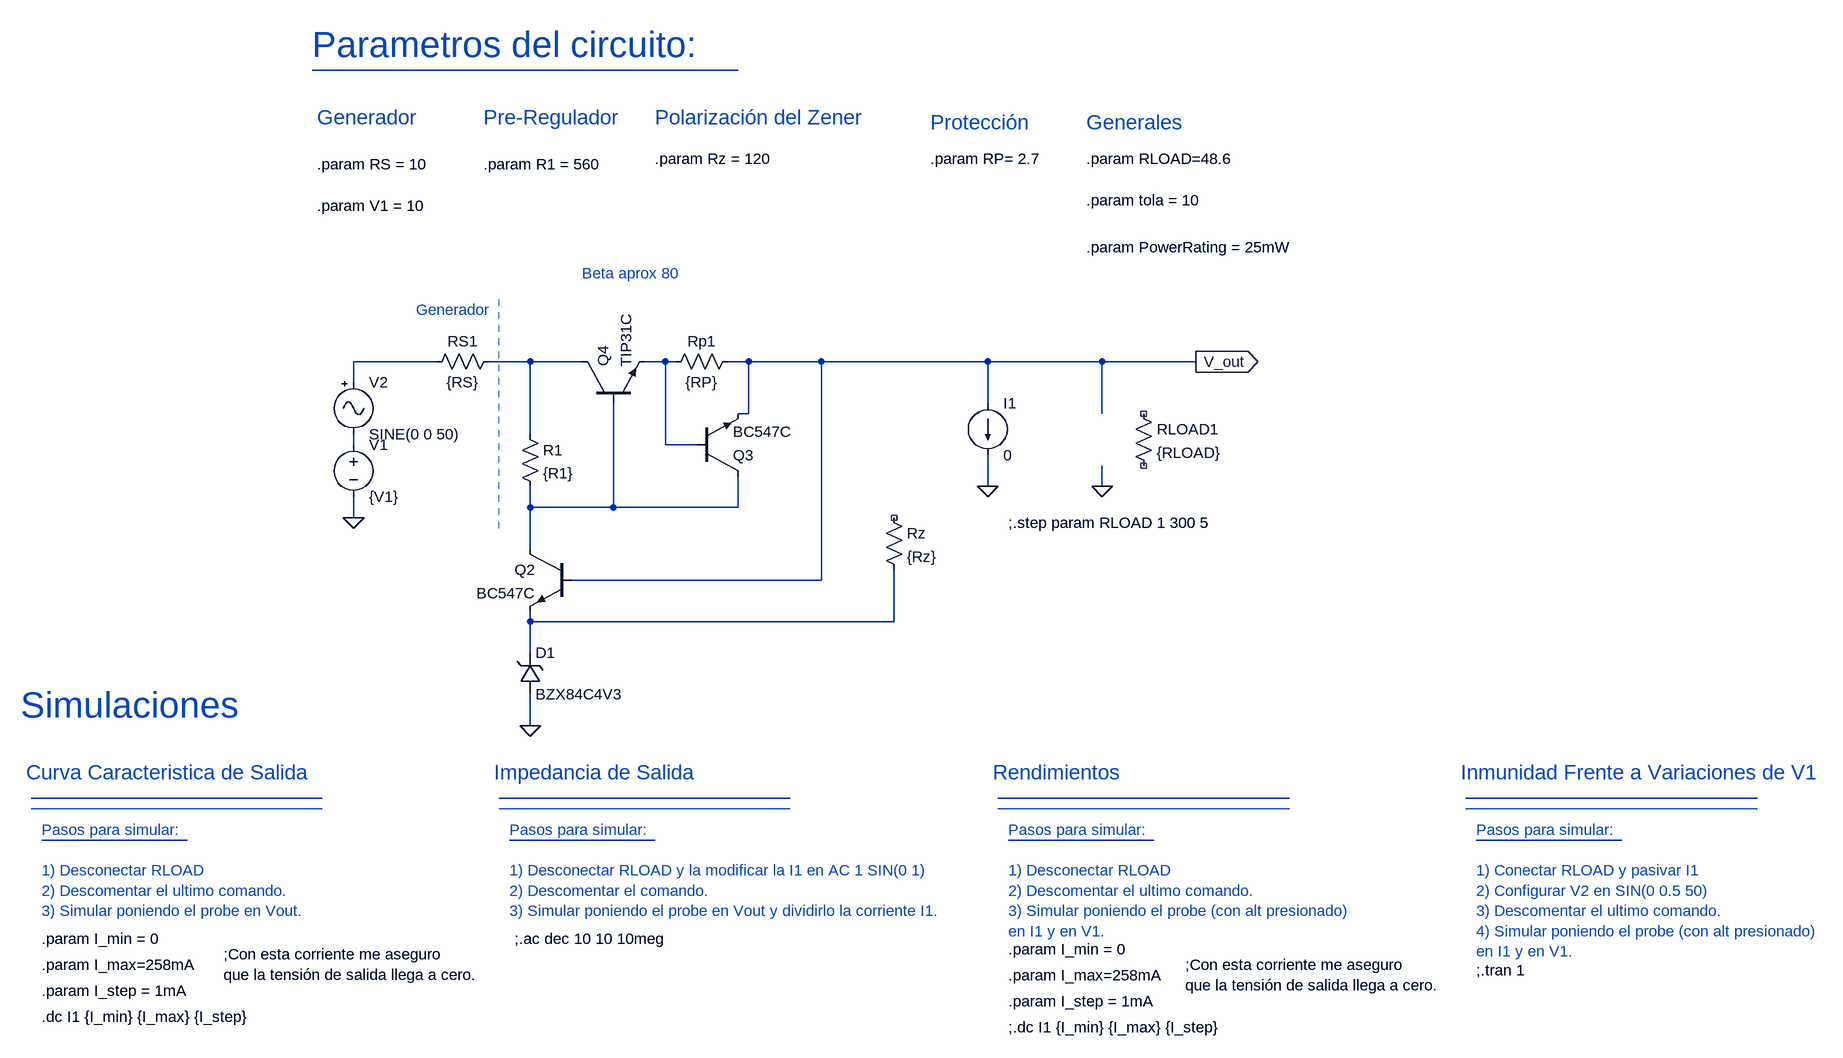
[diagram p0: schematic Fuente 5V.asc]
Fuente 5V.asc, the LTspice schematic file:
Version 4
SHEET 1 1956 1320
WIRE -416 -336 -1072 -336
WIRE -880 112 -1008 112
WIRE -736 112 -800 112
WIRE -656 112 -736 112
WIRE -528 112 -560 112
WIRE -512 112 -528 112
WIRE -400 112 -432 112
WIRE -288 112 -400 112
WIRE -32 112 -288 112
WIRE 144 112 -32 112
WIRE 288 112 144 112
WIRE -1008 144 -1008 112
WIRE -32 176 -32 112
WIRE -400 192 -400 112
WIRE -400 192 -416 192
WIRE 144 192 144 112
WIRE -736 224 -736 112
WIRE -1008 240 -1008 224
WIRE -528 240 -528 112
WIRE -480 240 -528 240
WIRE -32 304 -32 256
WIRE 144 304 144 272
WIRE -736 336 -736 304
WIRE -608 336 -608 176
WIRE -608 336 -736 336
WIRE -416 336 -416 288
WIRE -416 336 -608 336
WIRE -1008 352 -1008 320
WIRE -736 400 -736 336
WIRE -288 448 -288 112
WIRE -288 448 -672 448
WIRE -736 512 -736 496
WIRE -176 512 -176 432
WIRE -176 512 -736 512
WIRE -736 560 -736 512
WIRE -736 672 -736 624
WIRE -1056 784 -1504 784
WIRE -336 784 -784 784
WIRE 432 784 -16 784
WIRE 1152 784 704 784
WIRE -1264 848 -1488 848
WIRE -544 848 -768 848
WIRE 224 848 0 848
WIRE 944 848 720 848
FLAG -1008 352 0
FLAG -736 672 0
FLAG 144 304 0
FLAG -32 304 0
FLAG 288 112 V_out
IOPIN 288 112 Out
DATAFLAG -32 112 "I(Rload)"
DATAFLAG 144 112 ""
DATAFLAG -304 112 ""
DATAFLAG -736 112 ""
DATAFLAG -736 336 ""
SYMBOL voltage -1008 224 R0
WINDOW 123 0 0 Left 0
WINDOW 39 0 0 Left 0
SYMATTR InstName V1
SYMATTR Value {V1}
SYMBOL res -784 96 R90
WINDOW 0 0 56 VBottom 2
WINDOW 3 32 56 VTop 2
SYMATTR InstName RS1
SYMATTR Value {RS}
SYMATTR SpiceLine tol={tola} pwr={PowerRating }
SYMBOL npn -672 400 M0
SYMATTR InstName Q2
SYMATTR Value BC547C
SYMBOL zener -752 624 M180
WINDOW 0 24 64 Left 2
WINDOW 3 24 0 Left 2
SYMATTR InstName D1
SYMATTR Value BZX84C4V3
SYMBOL res 192 176 R0
SYMATTR InstName RLOAD1
SYMATTR Value {RLOAD}
SYMATTR SpiceLine tol={tola} pwr={PowerRating}
SYMBOL res -416 96 R90
WINDOW 0 0 56 VBottom 2
WINDOW 3 32 56 VTop 2
SYMATTR InstName Rp1
SYMATTR Value {RP}
SYMATTR SpiceLine tol={tola} pwr={PowerRating}
SYMBOL res -752 208 R0
SYMATTR InstName R1
SYMATTR Value {R1}
SYMATTR SpiceLine tol={tola} pwr={PowerRating}
SYMBOL res -192 336 R0
SYMATTR InstName Rz
SYMATTR Value {Rz}
SYMATTR SpiceLine tol={tola} pwr={PowerRating}
SYMBOL current -32 176 R0
WINDOW 123 0 0 Left 0
WINDOW 39 0 0 Left 0
SYMATTR InstName I1
SYMATTR Value 0
SYMBOL npn -480 288 M180
SYMATTR InstName Q3
SYMATTR Value BC547C
SYMBOL Misc\\signal -1008 128 R0
WINDOW 123 0 0 Left 0
WINDOW 39 0 0 Left 0
SYMATTR InstName V2
SYMATTR Value SINE(0 0 50)
SYMBOL npn -656 176 R270
SYMATTR InstName Q4
SYMATTR Value TIP31C
TEXT -912 32 Left 2 ;Generador
TEXT -656 -24 Left 2 ;Beta aprox 80
TEXT 0 360 Left 2 !;.step param RLOAD 1 300 5
TEXT -1520 640 Left 5 ;Simulaciones
TEXT -1512 744 Left 3 ;Curva Caracteristica de Salida
TEXT -1488 1000 Left 2 !.param I_min = 0
TEXT -1488 1040 Left 2 !.param I_max=258mA
TEXT -1488 1080 Left 2 !.param I_step = 1mA
TEXT -1488 832 Left 2 ;Pasos para simular:\n \n1) Desconectar RLOAD\n2) Descomentar el ultimo comando.\n3) Simular poniendo el probe en Vout.
TEXT -1072 -376 Left 5 ;Parametros del circuito:
TEXT -1064 -192 Left 2 !.param RS = 10
TEXT -1064 -128 Left 2 !.param V1 = 10
TEXT -808 -192 Left 2 !.param R1 = 560
TEXT -1064 -264 Left 3 ;Generador
TEXT -808 -264 Left 3 ;Pre-Regulador
TEXT -544 -264 Left 3 ;Polarización del Zener
TEXT -544 -200 Left 2 !.param Rz = 120
TEXT -120 -200 Left 2 !.param RP= 2.7
TEXT 720 1048 Left 2 !;.tran 1
TEXT -120 -256 Left 3 ;Protección
TEXT 120 -136 Left 2 !.param tola = 10
TEXT 120 -200 Left 2 !.param RLOAD=48.6
TEXT 120 -256 Left 3 ;Generales
TEXT 120 -64 Left 2 !.param PowerRating = 25mW
TEXT -1488 1120 Left 2 !.dc I1 {I_min} {I_max} {I_step}
TEXT -1208 1024 Left 2 !;Con esta corriente me aseguro\nque la tensión de salida llega a cero.
TEXT -792 744 Left 3 ;Impedancia de Salida
TEXT -768 832 Left 2 ;Pasos para simular:\n \n1) Desconectar RLOAD y la modificar la I1 en AC 1 SIN(0 1)\n2) Descomentar el comando.\n3) Simular poniendo el probe en Vout y dividirlo la corriente I1.
TEXT -760 1000 Left 2 !;.ac dec 10 10 10meg
TEXT -24 744 Left 3 ;Rendimientos
TEXT 0 832 Left 2 ;Pasos para simular:\n \n1) Desconectar RLOAD\n2) Descomentar el ultimo comando.\n3) Simular poniendo el probe (con alt presionado)\nen I1 y en V1.
TEXT 0 1016 Left 2 !.param I_min = 0
TEXT 0 1056 Left 2 !.param I_max=258mA
TEXT 0 1096 Left 2 !.param I_step = 1mA
TEXT 0 1136 Left 2 !;.dc I1 {I_min} {I_max} {I_step}
TEXT 272 1040 Left 2 !;Con esta corriente me aseguro\nque la tensión de salida llega a cero.
TEXT 696 744 Left 3 ;Inmunidad Frente a Variaciones de V1
TEXT 720 832 Left 2 ;Pasos para simular:\n \n1) Conectar RLOAD y pasivar I1\n2) Configurar V2 en SIN(0 0.5 50)\n3) Descomentar el ultimo comando.\n4) Simular poniendo el probe (con alt presionado)\nen I1 y en V1.
LINE Normal -784 368 -784 16 2
LINE Normal -1056 800 -1504 800
LINE Normal -336 800 -784 800
LINE Normal 432 800 -16 800
LINE Normal 1152 800 704 800

The netlist it stands for:
* Fuente 5V.asc
V1 N005 0 {V1}
RS1 N003 N002 {RS} tol={tola} pwr={PowerRating }
Q2 N006 V_out N007 0 BC547C
D1 0 N007 BZX84C4V3
RLOAD1 NC_01 NC_02 {RLOAD} tol={tola} pwr={PowerRating}
Rp1 V_out N004 {RP} tol={tola} pwr={PowerRating}
R1 N003 N006 {R1} tol={tola} pwr={PowerRating}
Rz NC_03 N007 {Rz} tol={tola} pwr={PowerRating}
I1 V_out 0 0
Q3 N006 N004 V_out 0 BC547C
V2 N002 N005 SINE(0 0 50)
Q4 N003 N006 N004 0 TIP31C
.model D D
.lib standard.dio
.model NPN NPN
.model PNP PNP
.lib standard.bjt
* Generador
* Beta aprox 80
;.step param RLOAD 1 300 5
* Simulaciones
* Curva Caracteristica de Salida
.param I_min = 0
.param I_max=258mA
.param I_step = 1mA
* Pasos para simular:
* 1) Desconectar RLOAD
* 2) Descomentar el ultimo comando.
* 3) Simular poniendo el probe en Vout.
* Parametros del circuito:
.param RS = 10
.param V1 = 10
.param R1 = 560
* Generador
* Pre-Regulador
* Polarización del Zener
.param Rz = 120
.param RP= 2.7
;.tran 1
* Protección
.param tola = 10
.param RLOAD=48.6
* Generales
.param PowerRating = 25mW
.dc I1 {I_min} {I_max} {I_step}
;Con esta corriente me aseguro
que la tensión de salida llega a cero.
* Impedancia de Salida
* Pasos para simular:
* 1) Desconectar RLOAD y la modificar la I1 en AC 1 SIN(0 1)
* 2) Descomentar el comando.
* 3) Simular poniendo el probe en Vout y dividirlo la corriente I1.
;.ac dec 10 10 10meg
* Rendimientos
* Pasos para simular:
* 1) Desconectar RLOAD
* 2) Descomentar el ultimo comando.
* 3) Simular poniendo el probe (con alt presionado)
* en I1 y en V1.
.param I_min = 0
.param I_max=258mA
.param I_step = 1mA
;.dc I1 {I_min} {I_max} {I_step}
;Con esta corriente me aseguro
que la tensión de salida llega a cero.
* Inmunidad Frente a Variaciones de V1
* Pasos para simular:
* 1) Conectar RLOAD y pasivar I1
* 2) Configurar V2 en SIN(0 0.5 50)
* 3) Descomentar el ultimo comando.
* 4) Simular poniendo el probe (con alt presionado)
* en I1 y en V1.
.backanno
.end